# Altium project PCB_ProjectTP1.PrjPCB
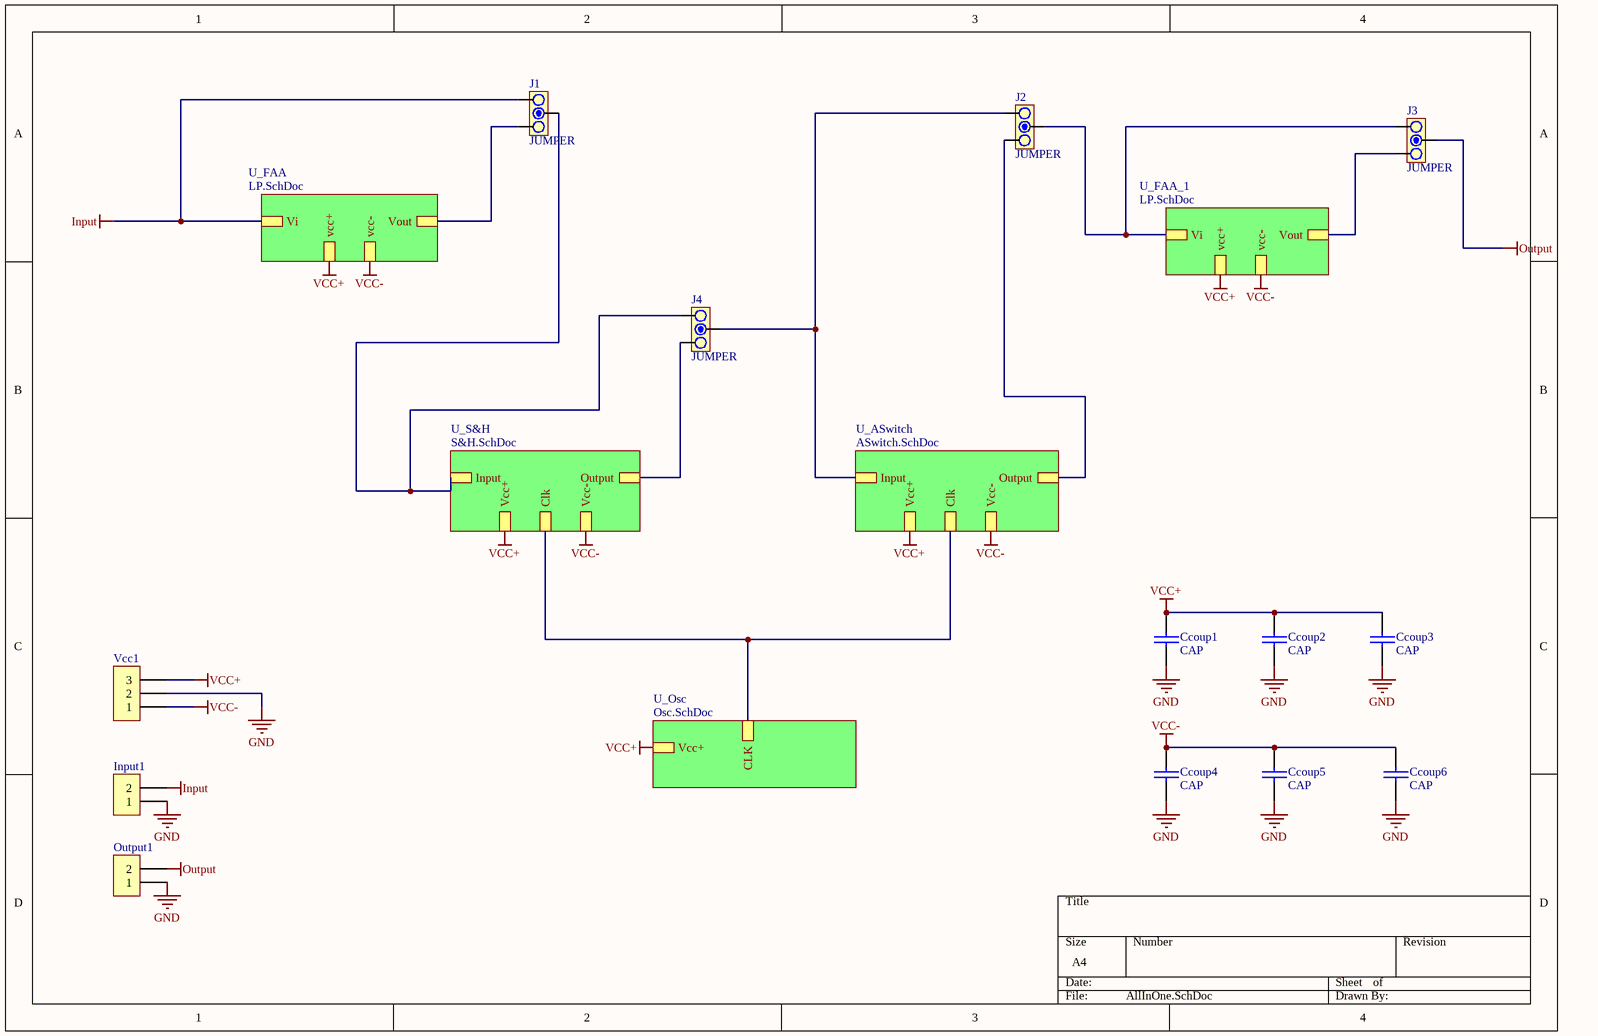
[diagram p0: AllInOne.SchDoc]
5 sheets, 119 parts. Net scope: hierarchical (ports join the sheet entries above them; power ports are global).
Sheets:
  AllInOne.SchDoc
    U_FAA = LP.SchDoc
    U_FAA_1 = LP.SchDoc
    U_S&H = S&H.SchDoc
    U_ASwitch = ASwitch.SchDoc
    U_Osc = Osc.SchDoc

## Sheet AllInOne.SchDoc
size A4

### Parts
Ccoup1  CAP  [0805]
Ccoup2  CAP  [0805]
Ccoup3  CAP  [0805]
Ccoup4  CAP  [0805]
Ccoup5  CAP  [0805]
Ccoup6  CAP  [0805]
Input1  BORNERA 2  [BORNERA2]  (value not drawn)
J1  JUMPER  [JUMPER3]
J2  JUMPER  [JUMPER3]
J3  JUMPER  [JUMPER3]
J4  JUMPER  [JUMPER3]
Output1  BORNERA 2  [BORNERA2]  (value not drawn)
Vcc1  BORNERA 3  [BORNERA3]  (value not drawn)

### Sub-sheets
U_ASwitch = ASwitch.SchDoc: Input, Output, Vcc+, Vcc-, Clk
U_FAA = LP.SchDoc: vcc+, vcc-, Vi, Vout
U_FAA_1 = LP.SchDoc: vcc+, vcc-, Vi, Vout
U_Osc = Osc.SchDoc: CLK, Vcc+
U_S&H = S&H.SchDoc: Output, Input, Vcc+, Clk, Vcc-

### Nets
Clk1: sheet U_S&H/Clk, sheet U_ASwitch/Clk, sheet U_Osc/CLK
Input: Input1.2 J1.3 ; sheet U_FAA/Vi  [project net Vi(0.55)]
Input1: J1.2 J4.3 ; sheet U_S&H/Input
Input2: J2.3 J4.2 ; sheet U_ASwitch/Input
Output: J3.2 Output1.2
Output1: J4.1 ; sheet U_S&H/Output
Output2: J2.1 ; sheet U_ASwitch/Output
Vcc+: Ccoup1.1 Ccoup2.1 Ccoup3.1 Vcc1.3 ; sheet U_FAA/vcc+, sheet U_FAA_1/vcc+, sheet U_S&H/Vcc+, sheet U_ASwitch/Vcc+, sheet U_Osc/Vcc+
Vcc-: Ccoup1.2 Ccoup2.2 Ccoup3.2 Ccoup4.1 Ccoup4.2 Ccoup5.1 Ccoup5.2 Ccoup6.1 Ccoup6.2 Input1.1 Output1.1 Vcc1.1 Vcc1.2 ; sheet U_FAA/vcc-, sheet U_FAA_1/vcc-, sheet U_S&H/Vcc-, sheet U_ASwitch/Vcc-  [also labelled GND]
Vi(0.55): J2.2 J3.3 ; sheet U_FAA_1/Vi
Vo(TT): J1.1 ; sheet U_FAA/Vout
Vo(TT): J3.1 ; sheet U_FAA_1/Vout  [a separate net that carries the same name]

### Library data of the parts
J1-J4 = JUMPER3

## Sheet LP.SchDoc
size A4
Used 2 times, as channels U_FAA, U_FAA_1. Parts and nets are listed once, with the designators drawn on the sheet.
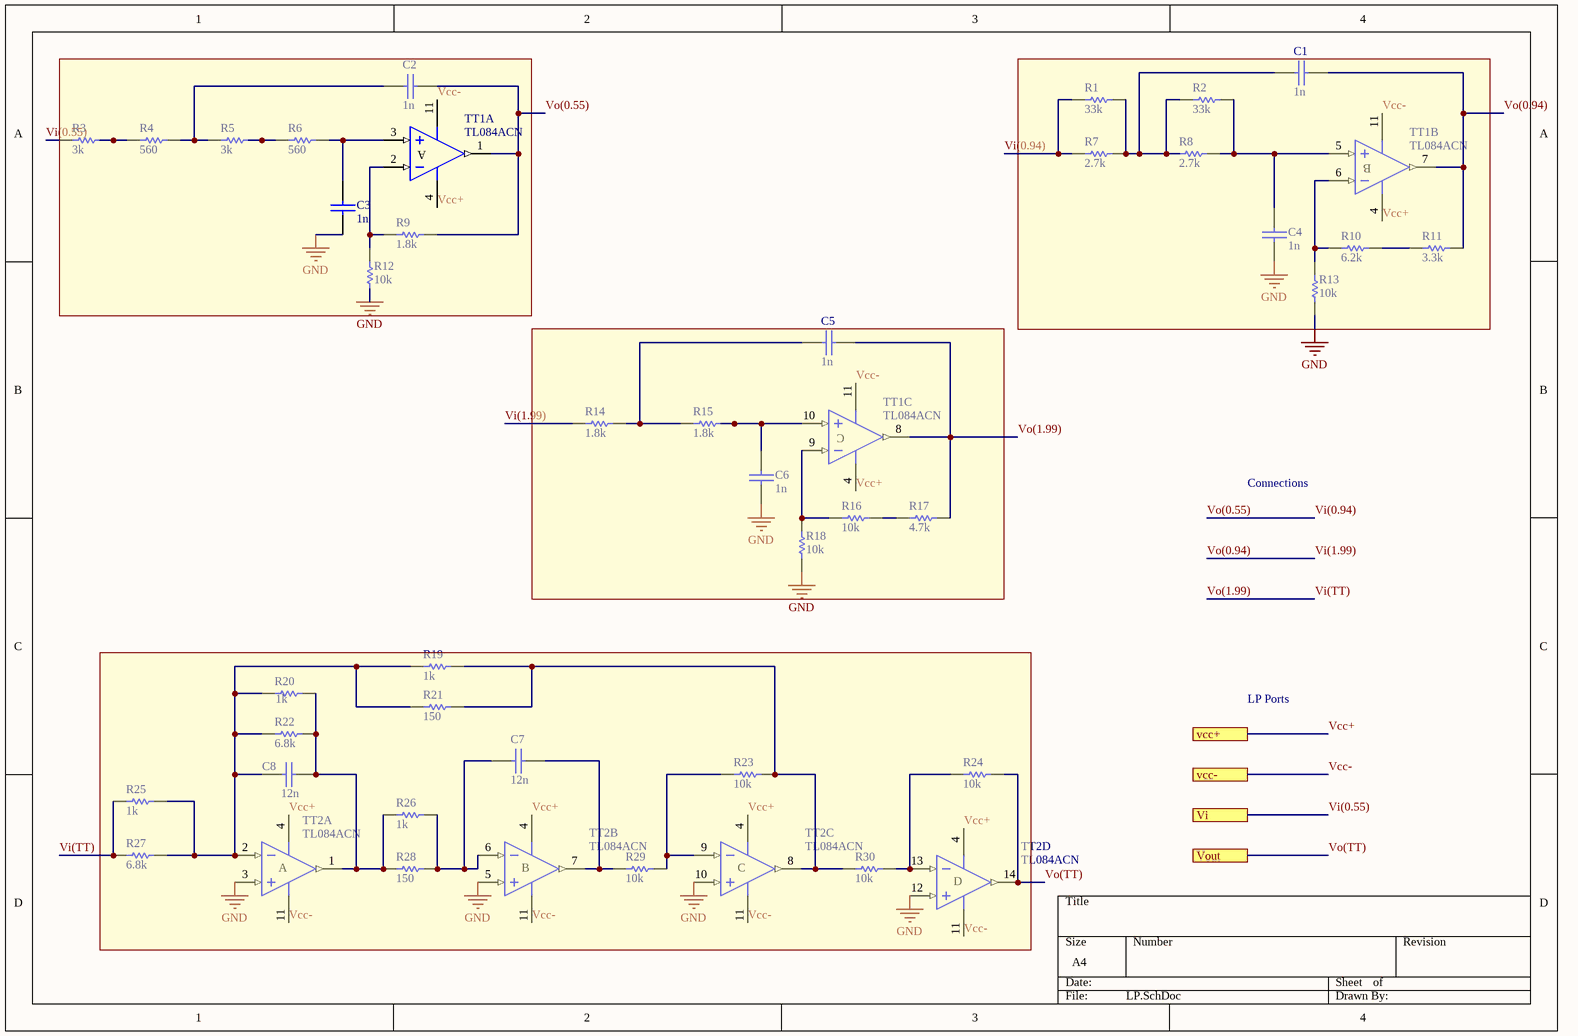
[diagram p1: LP.SchDoc]

### Parts
C1  1n  [0805]
C2  1n  [0805]
C3  1n  [0805]
C4  1n  [0805]
C5  1n  [0805]
C6  1n  [0805]
C7  12n  [0805]
C8  12n  [0805]
R1  33k  [0805]
R2  33k  [0805]
R3  3k  [0805]
R4  560  [0805]
R5  3k  [0805]
R6  560  [0805]
R7  2.7k  [0805]
R8  2.7k  [0805]
R9  1.8k  [0805]
R10  6.2k  [0805]
R11  3.3k  [0805]
R12  10k  [0805]
R13  10k  [0805]
R14  1.8k  [0805]
R15  1.8k  [0805]
R16  10k  [0805]
R17  4.7k  [0805]
R18  10k  [0805]
R19  1k  [0805]
R20  1k  [0805]
R21  150  [0805]
R22  6.8k  [0805]
R23  10k  [0805]
R24  10k  [0805]
R25  1k  [0805]
R26  1k  [0805]
R27  6.8k  [0805]
R28  150  [0805]
R29  10k  [0805]
R30  10k  [0805]
TT1  TL084ACN  [DIP14]  (parts A,B,C of 4)
TT2  TL084ACN  [DIP14]  (parts A,B,C,D of 4)

### Ports
vcc+, vcc-, Vi, Vout

### Nets
GND: C3.1 C4.1 C6.1 R12.1 R13.1 R18.1 TT2.3(IN+) TT2.5(IN+) TT2.10(IN+) TT2.12(IN+)
Vcc+: TT1.4(V+) TT2.4(V+) ; port vcc+
Vcc-: TT1.11(V-) TT2.11(V-) ; port vcc-
Vi(0.55): R3.1 ; port Vi
Vi(0.94): C2.2 R1.1 R7.1 R9.1 TT1.1(OUT)  [also labelled Vo(0.55)]
Vi(1.99): C1.2 R11.2 R14.1 TT1.7(OUT)  [also labelled Vo(0.94)]
Vi(TT): C5.2 R17.1 R25.1 R27.1 TT1.8(OUT)  [also labelled Vo(1.99)]
Vo(TT): R24.2 TT2.14(OUT) ; port Vout
NetC1_1: C1.1 R1.2 R2.1 R7.2 R8.1
NetC2_1: C2.1 R4.2 R5.1
NetC3_2: C3.2 R6.2 TT1.3(IN+)
NetC4_2: C4.2 R2.2 R8.2 TT1.5(IN+)
NetC5_1: C5.1 R14.2 R15.1
NetC6_2: C6.2 R15.2 TT1.10(IN+)
NetC7_1: C7.1 R26.2 R28.2 TT2.6(IN-)
NetC7_2: C7.2 R29.1 TT2.7(OUT)
NetC8_1: C8.1 R19.1 R20.1 R21.1 R22.1 R25.2 R27.2 TT2.2(IN-)
NetC8_2: C8.2 R20.2 R22.2 R26.1 R28.1 TT2.1(OUT)
NetR3_2: R3.2 R4.1
NetR5_2: R5.2 R6.1
NetR9_2: R9.2 R12.2 TT1.2(IN-)
NetR10_1: R10.1 R11.1
NetR10_2: R10.2 R13.2 TT1.6(IN-)
NetR16_1: R16.1 R17.2
NetR16_2: R16.2 R18.2 TT1.9(IN-)
NetR19_2: R19.2 R21.2 R23.2 R30.1 TT2.8(OUT)
NetR23_1: R23.1 R29.2 TT2.9(IN-)
NetR24_1: R24.1 R30.2 TT2.13(IN-)

### Channels
U_FAA: designators end in _U_FAA; ports vcc+=Vcc+ vcc-=Vcc- Vi=Vi(0.55) Vout=Vo(TT)
U_FAA_1: designators end in _U_FAA_1; ports vcc+=Vcc+ vcc-=Vcc- Vi=Vi(0.55) Vout=Vo(TT)

### Notes on the sheet
- Connections
- LP Ports
- (in symbol TL084ACN, part A) A
- (in symbol TL084ACN, part B) B
- (in symbol TL084ACN, part C) C
- (in symbol TL084ACN, part D) D

### Library data of the parts
C1-C8 = CAP
R1-R30 = RES
TT1 TT2 = TL084ACN: General-Purpose J-FET Quad Operational Amplifier; Published: 24-Aug-2001; LatestRevisionDate: 06-Jun-2005; LatestRevisionNote: Stylized 3D Model Added.; DatasheetVersion: Jan-1999; PackageVersion: Jan-1997; PackageReference: DIP14; Publisher: Altium Limited; PackageDescription: DIP; 14 Leads; Row Spacing 7.62 mm; Pitch 2.54 mm; ComponentLink1Description: Manufacturer Link; ComponentLink1URL: http://www.st.com/; ComponentLink2Description: Datasheet; ComponentLink2URL: http://www.st.com/stonline/products/literature/ds/2301/tl084.pdf

## Sheet S&H.SchDoc
size A4
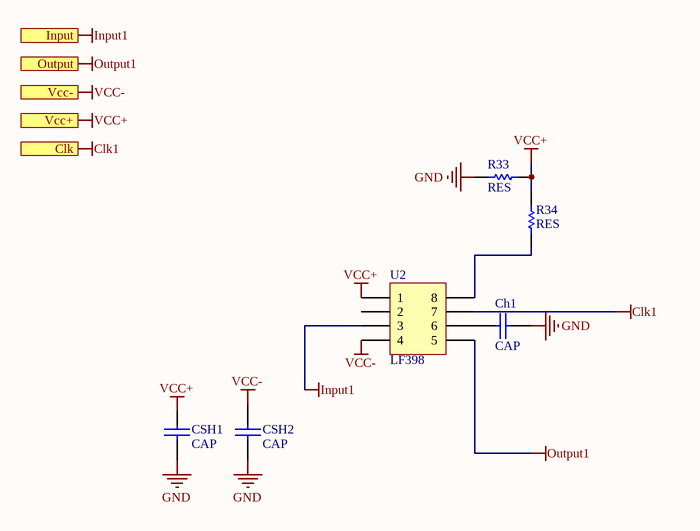
[diagram p2: S&H.SchDoc]

### Parts
Ch1  CAP  [CAP200]
CSH1  CAP  [CAP200]
CSH2  CAP  [CAP200]
R33  RES  [RES400]
R34  RES  [RES400]
U2  LF398  [DIP8]

### Ports
Clk, Input, Output, Vcc+, Vcc-

### Nets
Clk1: U2.7 ; port Clk
Input1: U2.3 ; port Input
Output1: U2.5 ; port Output
Vcc+: R33.2 R34.2 U2.1 ; port Vcc+
Vcc-: Ch1.2 CSH1.2 CSH2.1 CSH2.2 R33.1 U2.4 ; port Vcc-  [also labelled GND]
NetCh1_1: Ch1.1 U2.6
NetR34_1: R34.1 U2.8

Not connected (* = marked no-connect by the designer): CSH1 1; U2 2

### Notes on the sheet
- Labels drawn without touching a wire or pin: VCC+

### Library data of the parts
U2 = IC_DIP8

## Sheet ASwitch.SchDoc
size A4
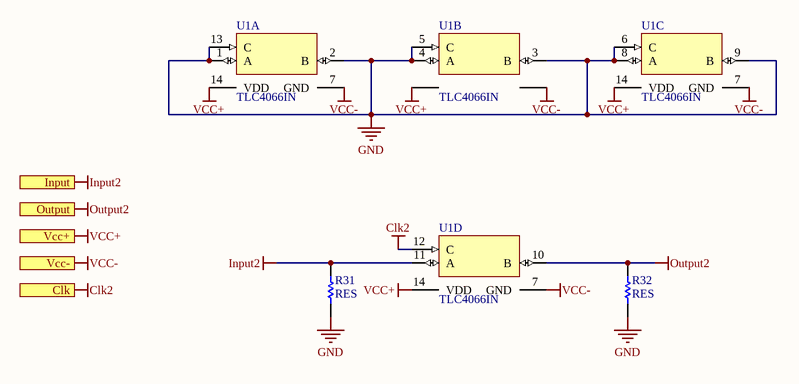
[diagram p3: ASwitch.SchDoc]

### Parts
R31  RES  [0805]
R32  RES  [0805]
U1  TLC4066IN  [N014]  (parts A,B,C,D of 4)

### Ports
Clk, Input, Output, Vcc+, Vcc-

### Nets
Clk2: U1.12(C) ; port Clk  [project net Clk1]
Input2: R31.2 U1.11(A) ; port Input
Output2: R32.2 U1.10(B) ; port Output
Vcc+: U1.14(VDD) ; port Vcc+  [also labelled VDD]
Vcc-: R31.1 R32.1 U1.1(A) U1.2(B) U1.3(B) U1.4(A) U1.5(C) U1.6(C) U1.7(GND) U1.8(A) U1.9(B) U1.13(C) ; port Vcc-  [also labelled GND]

### Library data of the parts
U1 = TLC4066IN: Quadruple Bilateral Analog Switch; Published: 8-Jun-2000; LatestRevisionDate: 04-Mar-2005; LatestRevisionNote: Stylized 3D Model Added.; DatasheetVersion: Jan-1986; PackageVersion: Oct-1995; PackageReference: N014; Publisher: Altium Limited; PackageDescription: DIP; 14 Leads; Row Spacing 7.62 mm; Pitch 2.54 mm; ComponentLink1Description: Manufacturer Link; ComponentLink1URL: http://www.ti.com/

## Sheet Osc.SchDoc
size A4
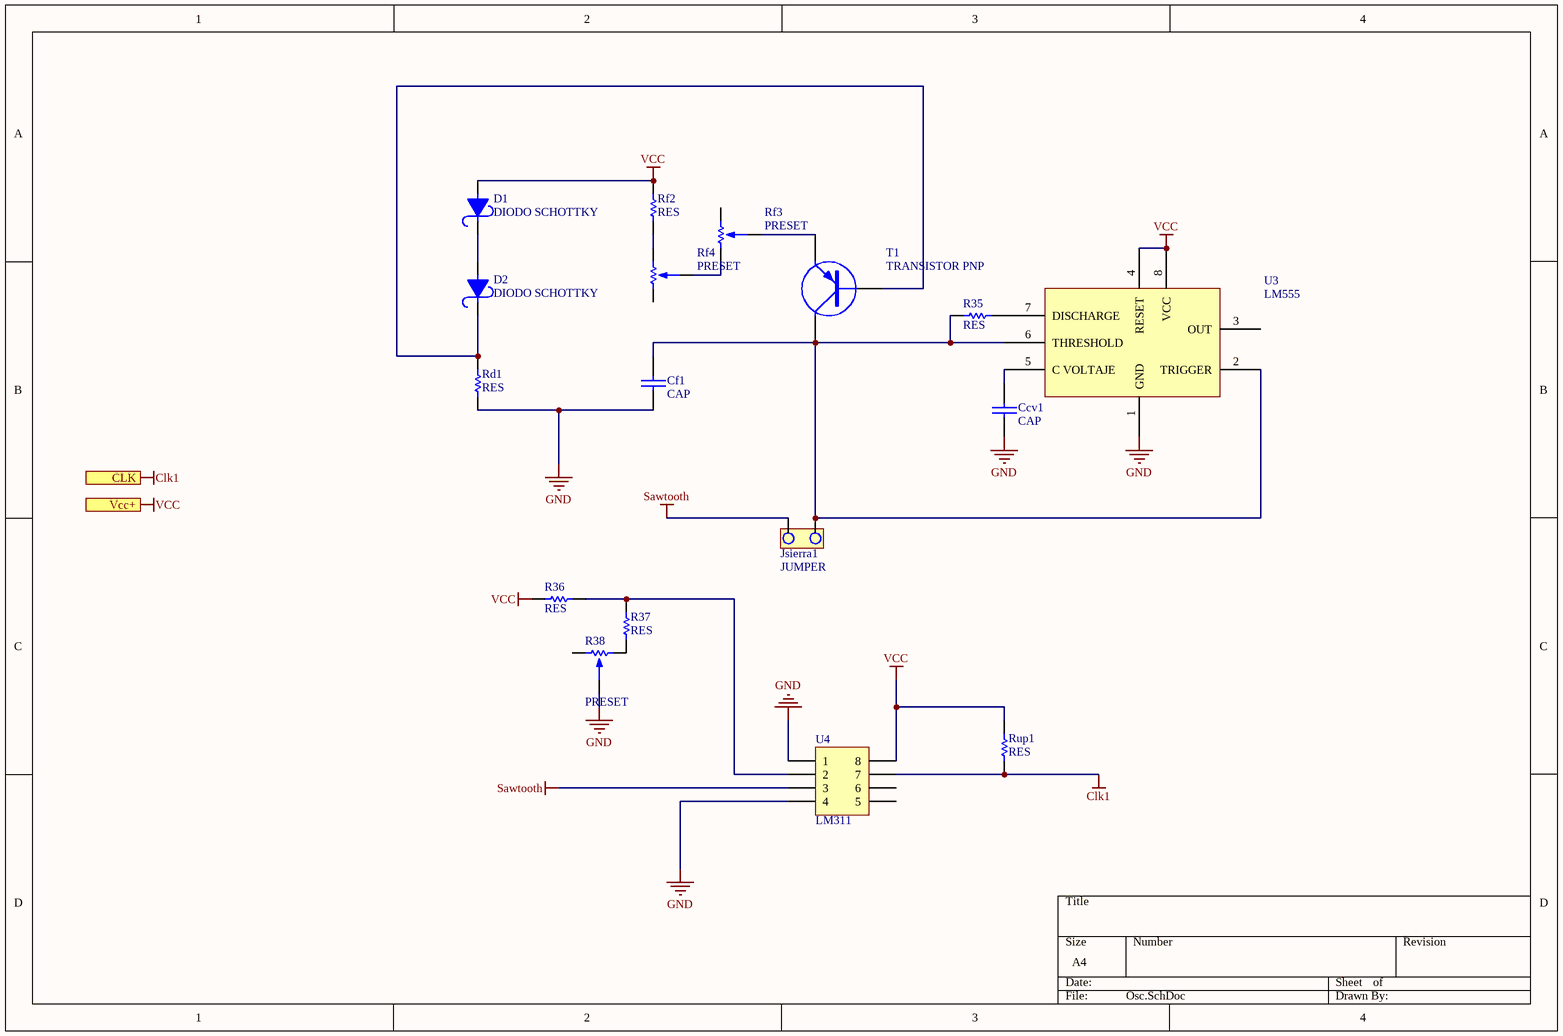
[diagram p4: Osc.SchDoc]

### Parts
Ccv1  CAP  [0805]
Cf1  CAP  [0805]
D1  DIODO SCHOTTKY  [DO41]
D2  DIODO SCHOTTKY  [DO41]
Jsierra1  JUMPER  [JUMPER2]
R35  RES  [0805]
R36  RES  [0805]
R37  RES  [0805]
R38  PRESET  [PRESET V]
Rd1  RES  [0805]
Rf2  RES  [0805]
Rf3  PRESET  [PRESET V]
Rf4  PRESET  [PRESET V]
Rup1  RES  [0805]
T1  TRANSISTOR PNP  [TO92]
U3  LM555  [DIP8]
U4  LM311  [DIP8]

### Ports
CLK, Vcc+

### Nets
Clk1: Rup1.1 U4.7 ; port CLK
GND: Ccv1.2 Cf1.2 R38.2 Rd1.1 U3.1(GND) U4.1 U4.4  [project net Vcc-]
Sawtooth: Jsierra1.1 U4.3
VCC: D1.1 R36.2 Rf2.2 Rup1.2 U3.4(RESET) U3.8(VCC) U4.8 ; port Vcc+  [project net Vcc+]
NetCcv1_1: Ccv1.1 U3.5(C_VOLTAJE)
NetCf1_1: Cf1.1 Jsierra1.2 R35.1 T1.2(C) U3.2(TRIGGER) U3.6(THRESHOLD)
NetD1_2: D1.2 D2.1
NetD2_2: D2.2 Rd1.2 T1.1(B)
NetR35_2: R35.2 U3.7(DISCHARGE)
NetR36_1: R36.1 R37.1 U4.2
NetR37_2: R37.2 R38.1
NetRf2_1: Rf2.1 Rf4.1
NetRf3_2: Rf3.2 T1.3(E)
NetRf3_3: Rf3.3 Rf4.2

Not connected (* = marked no-connect by the designer): R38 3; Rf3 1; Rf4 3; U3 3(OUT); U4 5 6

### Library data of the parts
U3 = LM555: Timer
U4 = IC_DIP8

## Nets that join several sheets
Clk1: S&H (U2.7), ASwitch (U1.12), Osc (Rup1.1 U4.7)
Input1: AllInOne (J1.2 J4.3), S&H (U2.3)
Input2: AllInOne (J2.3 J4.2), ASwitch (R31.2 U1.11)
Output1: AllInOne (J4.1), S&H (U2.5)
Output2: AllInOne (J2.1), ASwitch (R32.2 U1.10)
Vcc+: AllInOne (Ccoup1.1 Ccoup2.1 Ccoup3.1 Vcc1.3), U_FAA (TT1_U_FAA.4 TT2_U_FAA.4), U_FAA_1 (TT1_U_FAA_1.4 TT2_U_FAA_1.4), S&H (R33.2 R34.2 U2.1), ASwitch (U1.14), Osc (7 pins)
Vcc-: AllInOne (13 pins), U_FAA (12 pins), U_FAA_1 (12 pins), S&H (6 pins), ASwitch (12 pins), Osc (7 pins)
Vi(0.55): AllInOne (Input1.2 J1.3), U_FAA (R3_U_FAA.1)
Vi(0.55): AllInOne (J2.2 J3.3), U_FAA_1 (R3_U_FAA_1.1)
Vo(TT): AllInOne (J1.1), U_FAA (R24_U_FAA.2 TT2_U_FAA.14)
Vo(TT): AllInOne (J3.1), U_FAA_1 (R24_U_FAA_1.2 TT2_U_FAA_1.14)